# Altium schematic sheet InterfaceBoard.SchDoc: SPEXTRO - INTERFACE BOARD
size A4; Author: Derek Belsky; Revision: 0; SheetNumber: 1; SheetTotal: 2
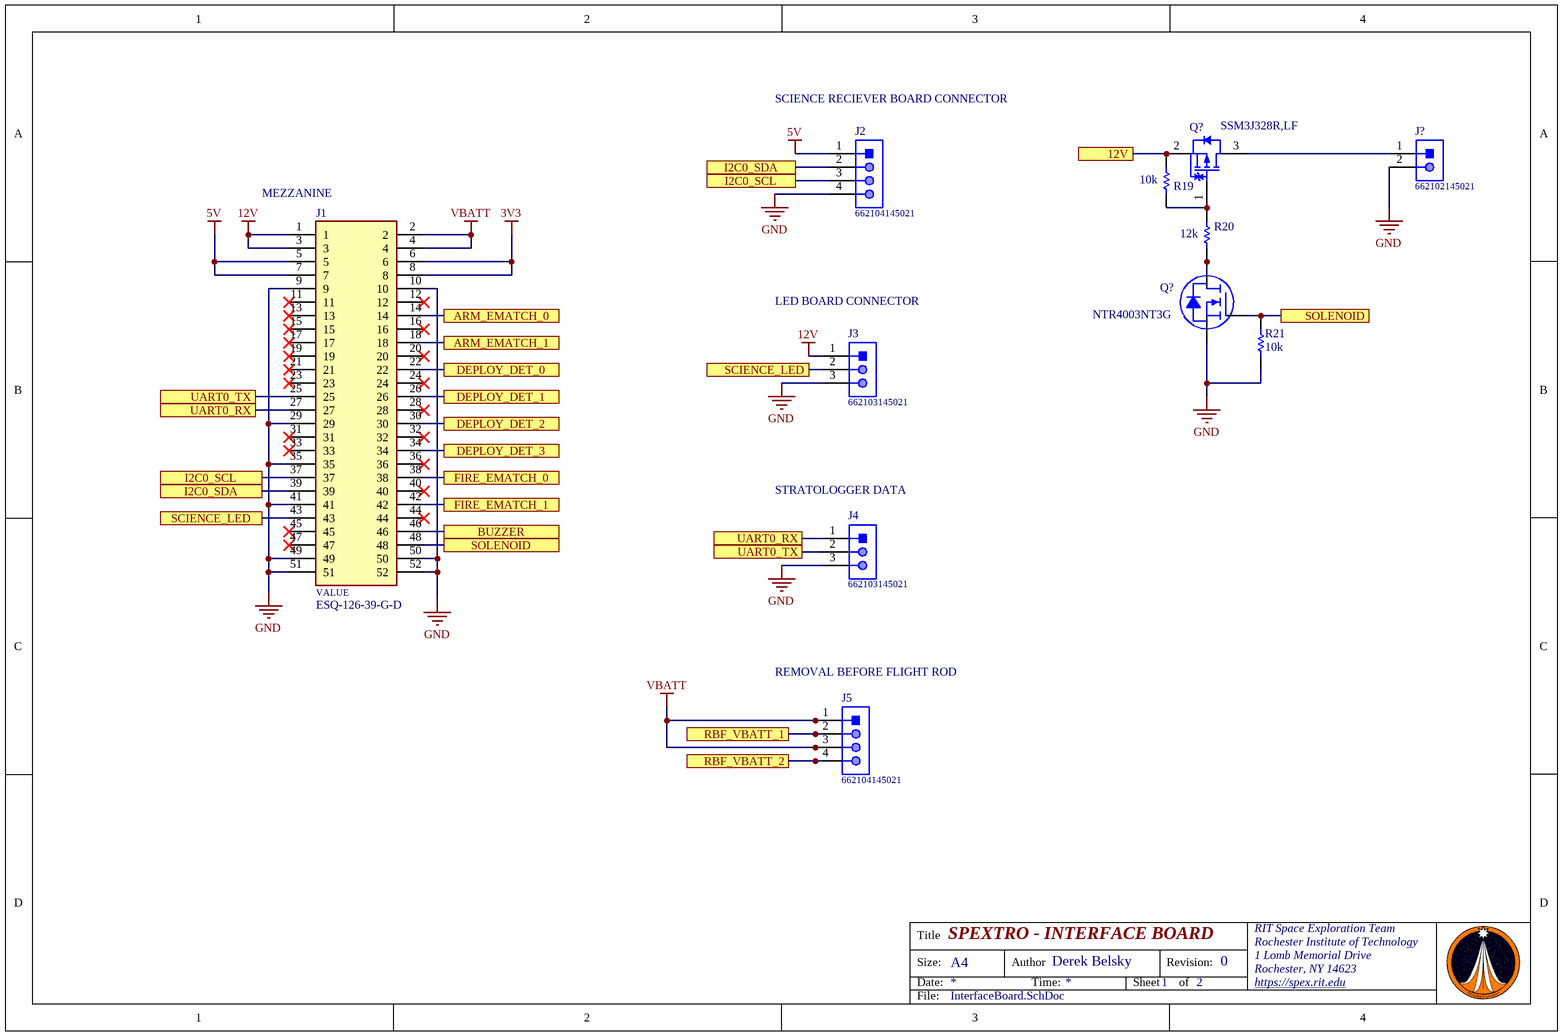
[diagram p0: InterfaceBoard.SchDoc]

## Parts
(Parts that share a designator on the sheet are numbered #1, #2 ... from top to bottom, then left to right.)
J1  ESQ-126-39-G-D  [SAMTEC_ESQ-126-39-G-D]
J2  662104145021  [662104145021]
J3  662103145021  [662103145021]
J4  662103145021  [662103145021]
J5  662104145021  [662104145021]
J?  662102145021  [662102145021]
Q?#1  SSM3J328R,LF  [TOSH-SOT-23F_V]
Q?#2  NTR4003NT3G  [ON SEMI SOT-23-3]
R19  value 10k  [RESC1609X50X30NL8T20]  (hidden comment: CRCW060310K0FKEA)
R20  value 12k  [RESC1609X50X30NL10T20]  (hidden comment: CRCW060312K0FKEA)
R21  value 10k  [RESC1609X50X30NL8T20]  (hidden comment: CRCW060310K0FKEA)

## Ports
12V, ARM_EMATCH_0, ARM_EMATCH_1, BUZZER, DEPLOY_DET_0, DEPLOY_DET_1, DEPLOY_DET_2, DEPLOY_DET_3, FIRE_EMATCH_0, FIRE_EMATCH_1, I2C0_SCL, I2C0_SDA, RBF_VBATT_1, RBF_VBATT_2, SCIENCE_LED, SOLENOID, UART0_RX, UART0_TX

## Nets
3V3: J1.6 J1.8
5V: J1.5 J1.7 J2.1
12V: J1.1 J1.3 J3.1
GND: J1.9 J1.10 J1.29 J1.35 J1.41 J1.49 J1.50 J1.51 J1.52 J2.4 J3.3 J4.3 J?.2 Q?#2.2(S) R21.2
VBATT: J1.2 J1.4 J5.1 J5.3
12V: Q?#1.2(S) R19.2 ; port 12V  [a separate net that carries the same name]
ARM_EMATCH_0: J1.14 ; port ARM_EMATCH_0
ARM_EMATCH_1: J1.18 ; port ARM_EMATCH_1
BUZZER: J1.46 ; port BUZZER
DEPLOY_DET_0: J1.22 ; port DEPLOY_DET_0
DEPLOY_DET_1: J1.26 ; port DEPLOY_DET_1
DEPLOY_DET_2: J1.30 ; port DEPLOY_DET_2
DEPLOY_DET_3: J1.34 ; port DEPLOY_DET_3
FIRE_EMATCH_0: J1.38 ; port FIRE_EMATCH_0
FIRE_EMATCH_1: J1.42 ; port FIRE_EMATCH_1
I2C0_SCL: J1.37 J2.3 ; port I2C0_SCL
I2C0_SDA: J1.39 J2.2 ; port I2C0_SDA
RBF_VBATT_1: J5.2 ; port RBF_VBATT_1
RBF_VBATT_2: J5.4 ; port RBF_VBATT_2
SCIENCE_LED: J1.43 J3.2 ; port SCIENCE_LED
SOLENOID: J1.48 Q?#2.1(G) R21.1 ; port SOLENOID
UART0_RX: J1.27 J4.1 ; port UART0_RX
UART0_TX: J1.25 J4.2 ; port UART0_TX
NetJ?_1: J?.1 Q?#1.3(D)
NetQ?#1_1: Q?#1.1(G) R19.1 R20.2
NetQ?#2_3: Q?#2.3(D) R20.1

Not connected (* = marked no-connect by the designer): J1 11* 12* 13* 15* 16* 17* 19* 20* 21* 23* 24* 28* 31* 32* 33* 36* 40* 44* 45* 47*

## Notes on the sheet
- (near J2) SCIENCE RECIEVER BOARD CONNECTOR
- (near J1) MEZZANINE
- (near J3) LED BOARD CONNECTOR
- (near J4) STRATOLOGGER DATA
- (near J5) REMOVAL BEFORE FLIGHT ROD
- Title
- Size:
- Date:
- A4
- Author
- Time:
- Sheet
- Revision:
- of
- RIT Space Exploration Team
- Rochester Institute of Technology
- 1 Lomb Memorial Drive
- Rochester, NY 14623
- https://spex.rit.edu
- File:
- (in symbol ESQ-126-39-G-D) VALUE

## Library data of the parts
J1 = ESQ-126-39-G-D: 52 Position Elevated Socket Connector Through Hole; MF: Samtec; Value: *; Digi-Key_Purchase_URL: https://www.digikey.com/product-detail/en/samtec-inc/ESQ-126-39-G-D/SAM10462-ND/3601055?utm_source=snapeda&utm_medium=aggregator&utm_campaign=symbol; Package: None; MP: ESQ-126-39-G-D; SnapEDA_Link: https://www.snapeda.com/parts/ESQ-126-39-G-D/Samtec%20Inc./view-part/490181/?ref=snap; Digi-Key_Part_Number: SAM10462-ND
J2 J5 = CMP-1502-00484-1: SMT Male Header WR-MPC3, with SMT Solder Tabs, Right Angled, Single Row, pitch 3 mm, 4 pins; Manufacturer: Wurth Elektronik; Pitch: 3mm; Pin Number: 4; Working Voltage: 250VAC; Contact Resistance: 10mOhm; Part Number: 662104145021; Packaging: TapeandReel; Manufacturer URL: http://www.we-online.de; Orientation: RightAngled; Datasheet URL: https://katalog.we-online.de/em/datasheet/6621xx145021.pdf; Operating Temperature: -40to105degC; Publisher: WurthElektronik; Mounting Technology: SMT; Gender: Male; Package Reference: 662104145021
J3 J4 = CMP-1502-00483-1: SMT Male Header WR-MPC3, with SMT Solder Tabs, Right Angled, Single Row, pitch 3 mm, 3 pins; Manufacturer: Wurth Elektronik; Pitch: 3mm; Working Voltage: 250VAC; Contact Resistance: 10mOhm; Pin Number: 3; Gender: Male; Datasheet URL: https://katalog.we-online.de/em/datasheet/6621xx145021.pdf; Manufacturer URL: http://www.we-online.de; Operating Temperature: -40to105degC; Mounting Technology: SMT; Packaging: TapeandReel; Publisher: WurthElektronik; Part Number: 662103145021; Package Reference: 662103145021; Orientation: RightAngled
J? = CMP-1502-00482-1: SMT Male Header WR-MPC3, with SMT Solder Tabs, Right Angled, Single Row, pitch 3 mm, 2 pins; Manufacturer: Wurth Elektronik; Contact Resistance: 10mOhm; Working Voltage: 250VAC; Pitch: 3mm; Pin Number: 2; Mounting Technology: SMT; Orientation: RightAngled; Part Number: 662102145021; Datasheet URL: https://katalog.we-online.de/em/datasheet/6621xx145021.pdf; Manufacturer URL: http://www.we-online.de; Packaging: TapeandReel; Publisher: WurthElektronik; Gender: Male; Operating Temperature: -40to105degC; Package Reference: 662102145021
Q?#1 = CMP-2100-03686-1: TOSHIBA Field-Effect Transistor Silicon P-Channel MOS Type (U-MOS VI), 20 V, -55 to 125 degC, 3-Pin SOTFL, RoHS, Tape and Reel; Gate to Source Voltage (Vgs): 8V; Drain to Source Breakdown Voltage: -20V; Turn-Off Delay Time: 107ns; Continuous Drain Current (ID): 6A; Rds On Max: 29.8mOhm; Number of Elements: 1; Turn-On Delay Time: 32ns; Drain to Source Resistance: 47.4mOhm; Drain to Source Voltage (Vdss): 20V; Power Dissipation: 2W; Element Configuration: Single; Max Power Dissipation: 1W; Input Capacitance: 840pF; Manufacturer URL: http://www.toshiba.com/; Number of Pins: 3; Number of Channels: 1; Max Operating Temperature: 150degC; Min Operating Temperature: -55degC; Manufacturer: Toshiba; Mount: SurfaceMount; Package Description: 3-Pin Small Outline Transistor, Flat Lead, Body 2.9 x 1.8 mm, Pitch 0.95 mm; Radiation Hardening: No; Package Quantity: 3000; Package Reference: SOT-23F; RoHSCompliant: true; Package URL: https://toshiba.semicon-storage.com/ap-en/design-support/package/detail.SOT-23F.html; Packaging: TapeandReel; Datasheet Version: 41699.0; Case/Package: SOT-23-3; Datasheet URL: https://toshiba.semicon-storage.com/info/docget.jsp?did=2429&prodName=SSM3J328R
Q?#2 = NTR4003NT3G: MOSFET N-CH 30V 500MA SOT-23; Manufacturer: ON Semiconductor; Current - Continuous Drain (Id) @ 25°C: 500mA (Ta); Drive Voltage (Max Rds On,  Min Rds On): 2.5V, 4V; FET Type: N-Channel; Gate Charge (Qg) (Max) @ Vgs: 1.15nC @ 5V; Input Capacitance (Ciss) (Max) @ Vds: 21pF @ 5V; Power Dissipation (Max): 690mW (Ta); Rds On (Max) @ Id, Vgs: 1.5Ohm @ 10mA, 4V; Vgs (Max): ±20V; Vgs(th) (Max) @ Id: 1.4V @ 250µA; Part Number: NTR4003NT3G; ComponentLink1Description: Datasheet; ComponentLink1URL: http://www.onsemi.com/pub/Collateral/NTR4003N-D.PDF; ComponentLink2Description: DigiKey Link; ComponentLink2URL: http://digikey.com/product-detail/en/on-semiconductor/NTR4003NT3G/NTR4003NT3GOSCT-ND/1967271; Device Package: TO-236-3, SC-59, SOT-23-3; Drain to Source Voltage (Vdss): 30V; LastUpdated: 1/21/2020 4:01:12 AM; Lifecycle Status: Active; Minimum Order: 1; Mounting Type: Surface Mount; Operating Temperature: -55°C ~ 150°C (TJ); Package / Case: TO-236-3, SC-59, SOT-23-3; Packaging: TapeAndReel; Part Status: Active; Price: 0.04; Series: -; Supplier 1: DigiKey; Supplier Part Number 1: NTR4003NT3GOSCT-ND; Supplier Device Package: SOT-23-3 (TO-236); Technology: MOSFET (Metal Oxide)
R19 R21 = CMP-1666-00005-4: Chip Resistor, 10 KOhm, +/- 1%, 100 mW, -55 to 155 degC, 0603 (1608 Metric), RoHS, Tape and Reel; Manufacturer: Vishay Semiconductor; Voltage Rating: 75 V; Max Operating Temperature: 155 degC; PackageDescription: 2-Pin Surface Mount Device, Body 1.575 x 0.85 mm; ComponentLink1Description: Manufacturer URL; RoHSCompliant: true; PackageReference: 0603; REACH SVHC: Unknown; Length: 1.55 mm; DatasheetVersion: 06/2012; Packaging: Tape and Reel; Min Operating Temperature: -55 degC; Mounting Technology: Surface Mount; ComponentLink2URL: https://datasheet.ciiva.com/11809/0900766b80d98afc-11809037.pdf; Height: 0.45 mm; ComponentLink2Description: Datasheet; Package Quantity: 5000; ComponentLink1URL: http://www.vishay.com/
R20 = CMP-2000-03877-1: Manufacturer: Vishay Dale; Part Number: CRCW060312K0FKEA